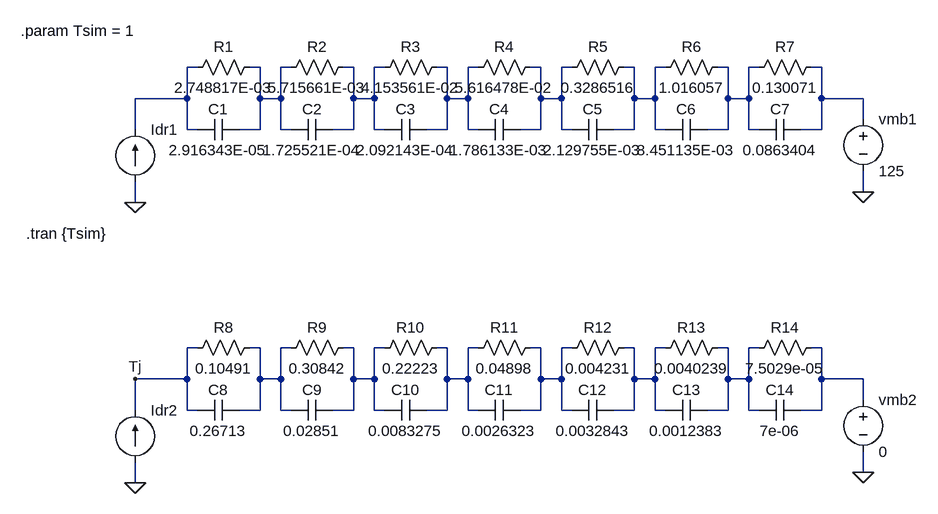
[diagram p0: schematic foster_test_matlab.asc]
* foster_test_matlab.asc
Idr1 0 N001 PWL(0              0          9e-10              0          1e-09              1  1.0209607e-09              1  1.0423607e-09              1  1.0642092e-09              1  1.0865158e-09              1  1.1092899e-09              1  1.1325413e-09              1  1.1562801e-09              1  1.1805165e-09              1  1.2052609e-09              1   1.230524e-09              1  1.2563166e-09              1  1.2826498e-09              1   1.309535e-09              1  1.3369837e-09              1  1.3650078e-09              1  1.3936193e-09              1  1.4228305e-09              1  1.4526539e-09              1  1.4831025e-09              1  1.5141893e-09              1  1.5459277e-09              1  1.5783314e-09              1  1.6114143e-09              1  1.6451906e-09              1  1.6796749e-09              1   1.714882e-09              1   1.750827e-09              1  1.7875255e-09              1  1.8249932e-09              1  1.8632463e-09              1  1.9023012e-09              0  1.9421747e-09              0  1.9828839e-09              0  2.0244465e-09              0  2.0668802e-09              1  2.1102034e-09              1  2.1544347e-09              1  2.1995931e-09              1   2.245698e-09              1  2.2927693e-09              1  2.3408273e-09              1  2.3898926e-09              1  2.4399863e-09              1    2.49113e-09              1  2.5433458e-09              1   2.596656e-09              1  2.6510836e-09              1  2.7066521e-09              1  2.7633853e-09              1  2.8213077e-09              1  2.8804442e-09              1  2.9408202e-09              1  3.0024617e-09              1  3.0653953e-09              1   3.129648e-09              1  3.1952475e-09              1   3.262222e-09              1  3.3306003e-09              1  3.4004119e-09              1  3.4716868e-09              1  3.5444557e-09              1  3.6187498e-09              1  3.6946012e-09              1  3.7720425e-09              1   3.851107e-09              1  3.9318288e-09              0  4.0142425e-09              0  4.0983837e-09              0  4.1842885e-09              0   4.271994e-09              1  4.3615378e-09              1  4.4529585e-09              1  4.5462955e-09              1  4.6415888e-09              1  4.7388796e-09              1  4.8382097e-09              1  4.9396217e-09              1  5.0431595e-09              1  5.1488675e-09              1  5.2567911e-09              1  5.3669769e-09              1  5.4794723e-09              1  5.5943257e-09              1  5.7115865e-09              1  5.8313051e-09              1  5.9535331e-09              1  6.0783231e-09              1  6.2057288e-09              1   6.335805e-09              1  6.4686077e-09              1   6.604194e-09              1  6.7426222e-09              1  6.8839521e-09              1  7.0282443e-09              1  7.1755609e-09              1  7.3259654e-09              1  7.4795225e-09              1  7.6362983e-09              1  7.7963601e-09              1   7.959777e-09              1  8.1266192e-09              0  8.2969585e-09              0  8.4708683e-09              0  8.6484233e-09              0     8.8297e-09              1  9.0147763e-09              1   9.203732e-09              1  9.3966483e-09              1  9.5936083e-09              1  9.7946967e-09              1          1e-08              1  1.0209607e-08              1  1.0423607e-08              1  1.0642092e-08              1  1.0865158e-08              1  1.1092899e-08              1  1.1325413e-08              1  1.1562801e-08              1  1.1805165e-08              1  1.2052609e-08              1   1.230524e-08              1  1.2563166e-08              1  1.2826498e-08              1   1.309535e-08              1  1.3369837e-08              1  1.3650078e-08              1  1.3936193e-08              1  1.4228305e-08              1  1.4526539e-08              1  1.4831025e-08              1  1.5141893e-08              1  1.5459277e-08              1  1.5783314e-08              1  1.6114143e-08              1  1.6451906e-08              1  1.6796749e-08              0   1.714882e-08              0   1.750827e-08              0  1.7875255e-08              0  1.8249932e-08              1  1.8632463e-08              1  1.9023012e-08              1  1.9421747e-08              1  1.9828839e-08              1  2.0244465e-08              1  2.0668802e-08              1  2.1102034e-08              1  2.1544347e-08              1  2.1995931e-08              1   2.245698e-08              1  2.2927693e-08              1  2.3408273e-08              1  2.3898926e-08              1  2.4399863e-08              1    2.49113e-08              1  2.5433458e-08              1   2.596656e-08              1  2.6510836e-08              1  2.7066521e-08              1  2.7633853e-08              1  2.8213077e-08              1  2.8804442e-08              1  2.9408202e-08              1  3.0024617e-08              1  3.0653953e-08              1   3.129648e-08              1  3.1952475e-08              1   3.262222e-08              1  3.3306003e-08              1  3.4004119e-08              1  3.4716868e-08              0  3.5444557e-08              0  3.6187498e-08              0  3.6946012e-08              0  3.7720425e-08              1   3.851107e-08              1  3.9318288e-08              1  4.0142425e-08              1  4.0983837e-08              1  4.1842885e-08              1   4.271994e-08              1  4.3615378e-08              1  4.4529585e-08              1  4.5462955e-08              1  4.6415888e-08              1  4.7388796e-08              1  4.8382097e-08              1  4.9396217e-08              1  5.0431595e-08              1  5.1488675e-08              1  5.2567911e-08              1  5.3669769e-08              1  5.4794723e-08              1  5.5943257e-08              1  5.7115865e-08              1  5.8313051e-08              1  5.9535331e-08              1  6.0783231e-08              1  6.2057288e-08              1   6.335805e-08              1  6.4686077e-08              1   6.604194e-08              1  6.7426222e-08              1  6.8839521e-08              1  7.0282443e-08              1  7.1755609e-08              0  7.3259654e-08              0  7.4795225e-08              0  7.6362983e-08              0  7.7963601e-08              1   7.959777e-08              1  8.1266192e-08              1  8.2969585e-08              1  8.4708683e-08              1  8.6484233e-08              1     8.8297e-08              1  9.0147763e-08              1   9.203732e-08              1  9.3966483e-08              1  9.5936083e-08              1  9.7946967e-08              1          1e-07              1  1.0209607e-07              1  1.0423607e-07              1  1.0642092e-07              1  1.0865158e-07              1  1.1092899e-07              1  1.1325413e-07              1  1.1562801e-07              1  1.1805165e-07              1  1.2052609e-07              1   1.230524e-07              1  1.2563166e-07              1  1.2826498e-07              1   1.309535e-07              1  1.3369837e-07              1  1.3650078e-07              1  1.3936193e-07              1  1.4228305e-07              1  1.4526539e-07              1  1.4831025e-07              0  1.5141893e-07              0  1.5459277e-07              0  1.5783314e-07              0  1.6114143e-07              1  1.6451906e-07              1  1.6796749e-07              1   1.714882e-07              1   1.750827e-07              1  1.7875255e-07              1  1.8249932e-07              1  1.8632463e-07              1  1.9023012e-07              1  1.9421747e-07              1  1.9828839e-07              1  2.0244465e-07              1  2.0668802e-07              1  2.1102034e-07              1  2.1544347e-07              1  2.1995931e-07              1   2.245698e-07              1  2.2927693e-07              1  2.3408273e-07              1  2.3898926e-07              1  2.4399863e-07              1    2.49113e-07              1  2.5433458e-07              1   2.596656e-07              1  2.6510836e-07              1  2.7066521e-07              1  2.7633853e-07              1  2.8213077e-07              1  2.8804442e-07              1  2.9408202e-07              1  3.0024617e-07              1  3.0653953e-07              0   3.129648e-07              0  3.1952475e-07              0   3.262222e-07              0  3.3306003e-07              1  3.4004119e-07              1  3.4716868e-07              1  3.5444557e-07              1  3.6187498e-07              1  3.6946012e-07              1  3.7720425e-07              1   3.851107e-07              1  3.9318288e-07              1  4.0142425e-07              1  4.0983837e-07              1  4.1842885e-07              1   4.271994e-07              1  4.3615378e-07              1  4.4529585e-07              1  4.5462955e-07              1  4.6415888e-07              1  4.7388796e-07              1  4.8382097e-07              1  4.9396217e-07              1  5.0431595e-07              1  5.1488675e-07              1  5.2567911e-07              1  5.3669769e-07              1  5.4794723e-07              1  5.5943257e-07              1  5.7115865e-07              1  5.8313051e-07              1  5.9535331e-07              1  6.0783231e-07              1  6.2057288e-07              1   6.335805e-07              0  6.4686077e-07              0   6.604194e-07              0  6.7426222e-07              0  6.8839521e-07              1  7.0282443e-07              1  7.1755609e-07              1  7.3259654e-07              1  7.4795225e-07              1  7.6362983e-07              1  7.7963601e-07              1   7.959777e-07              1  8.1266192e-07              1  8.2969585e-07              1  8.4708683e-07              1  8.6484233e-07              1     8.8297e-07              1  9.0147763e-07              1   9.203732e-07              1  9.3966483e-07              1  9.5936083e-07              1  9.7946967e-07              1          1e-06              1  1.0209607e-06              1  1.0423607e-06              1  1.0642092e-06              1  1.0865158e-06              1  1.1092899e-06              1  1.1325413e-06              1  1.1562801e-06              1  1.1805165e-06              1  1.2052609e-06              1   1.230524e-06              1  1.2563166e-06              1  1.2826498e-06              1   1.309535e-06              0  1.3369837e-06              0  1.3650078e-06              0  1.3936193e-06              0  1.4228305e-06              1  1.4526539e-06              1  1.4831025e-06              1  1.5141893e-06              1  1.5459277e-06              1  1.5783314e-06              1  1.6114143e-06              1  1.6451906e-06              1  1.6796749e-06              1   1.714882e-06              1   1.750827e-06              1  1.7875255e-06              1  1.8249932e-06              1  1.8632463e-06              1  1.9023012e-06              1  1.9421747e-06              1  1.9828839e-06              1  2.0244465e-06              1  2.0668802e-06              1  2.1102034e-06              1  2.1544347e-06              1  2.1995931e-06              1   2.245698e-06              1  2.2927693e-06              1  2.3408273e-06              1  2.3898926e-06              1  2.4399863e-06              1    2.49113e-06              1  2.5433458e-06              1   2.596656e-06              1  2.6510836e-06              1  2.7066521e-06              0  2.7633853e-06              0  2.8213077e-06              0  2.8804442e-06              0  2.9408202e-06              1  3.0024617e-06              1  3.0653953e-06              1   3.129648e-06              1  3.1952475e-06              1   3.262222e-06              1  3.3306003e-06              1  3.4004119e-06              1  3.4716868e-06              1  3.5444557e-06              1  3.6187498e-06              1  3.6946012e-06              1  3.7720425e-06              1   3.851107e-06              1  3.9318288e-06              1  4.0142425e-06              1  4.0983837e-06              1  4.1842885e-06              1   4.271994e-06              1  4.3615378e-06              1  4.4529585e-06              1  4.5462955e-06              1  4.6415888e-06              1  4.7388796e-06              1  4.8382097e-06              1  4.9396217e-06              1  5.0431595e-06              1  5.1488675e-06              1  5.2567911e-06              1  5.3669769e-06              1  5.4794723e-06              1  5.5943257e-06              0  5.7115865e-06              0  5.8313051e-06              0  5.9535331e-06              0  6.0783231e-06              1  6.2057288e-06              1   6.335805e-06              1  6.4686077e-06              1   6.604194e-06              1  6.7426222e-06              1  6.8839521e-06              1  7.0282443e-06              1  7.1755609e-06              1  7.3259654e-06              1  7.4795225e-06              1  7.6362983e-06              1  7.7963601e-06              1   7.959777e-06              1  8.1266192e-06              1  8.2969585e-06              1  8.4708683e-06              1  8.6484233e-06              1     8.8297e-06              1  9.0147763e-06              1   9.203732e-06              1  9.3966483e-06              1  9.5936083e-06              1  9.7946967e-06              1          1e-05              1  1.0209607e-05              1  1.0423607e-05              1  1.0642092e-05              1  1.0865158e-05              1  1.1092899e-05              1  1.1325413e-05              1  1.1562801e-05              0  1.1805165e-05              0  1.2052609e-05              0   1.230524e-05              0  1.2563166e-05              1  1.2826498e-05              1   1.309535e-05              1  1.3369837e-05              1  1.3650078e-05              1  1.3936193e-05              1  1.4228305e-05              1  1.4526539e-05              1  1.4831025e-05              1  1.5141893e-05              1  1.5459277e-05              1  1.5783314e-05              1  1.6114143e-05              1  1.6451906e-05              1  1.6796749e-05              1   1.714882e-05              1   1.750827e-05              1  1.7875255e-05              1  1.8249932e-05              1  1.8632463e-05              1  1.9023012e-05              1  1.9421747e-05              1  1.9828839e-05              1  2.0244465e-05              1  2.0668802e-05              1  2.1102034e-05              1  2.1544347e-05              1  2.1995931e-05              1   2.245698e-05              1  2.2927693e-05              1  2.3408273e-05              1  2.3898926e-05              0  2.4399863e-05              0    2.49113e-05              0  2.5433458e-05              0   2.596656e-05              1  2.6510836e-05              1  2.7066521e-05              1  2.7633853e-05              1  2.8213077e-05              1  2.8804442e-05              1  2.9408202e-05              1  3.0024617e-05              1  3.0653953e-05              1   3.129648e-05              1  3.1952475e-05              1   3.262222e-05              1  3.3306003e-05              1  3.4004119e-05              1  3.4716868e-05              1  3.5444557e-05              1  3.6187498e-05              1  3.6946012e-05              1  3.7720425e-05              1   3.851107e-05              1  3.9318288e-05              1  4.0142425e-05              1  4.0983837e-05              1  4.1842885e-05              1   4.271994e-05              1  4.3615378e-05              1  4.4529585e-05              1  4.5462955e-05              1  4.6415888e-05              1  4.7388796e-05              1  4.8382097e-05              1  4.9396217e-05              0  5.0431595e-05              0  5.1488675e-05              0  5.2567911e-05              0  5.3669769e-05              1  5.4794723e-05              1  5.5943257e-05              1  5.7115865e-05              1  5.8313051e-05              1  5.9535331e-05              1  6.0783231e-05              1  6.2057288e-05              1   6.335805e-05              1  6.4686077e-05              1   6.604194e-05              1  6.7426222e-05              1  6.8839521e-05              1  7.0282443e-05              1  7.1755609e-05              1  7.3259654e-05              1  7.4795225e-05              1  7.6362983e-05              1  7.7963601e-05              1   7.959777e-05              1  8.1266192e-05              1  8.2969585e-05              1  8.4708683e-05              1  8.6484233e-05              1     8.8297e-05              1  9.0147763e-05              1   9.203732e-05              1  9.3966483e-05              1  9.5936083e-05              1  9.7946967e-05              1         0.0001              1  0.00010209607              0  0.00010423607              0  0.00010642092              0  0.00010865158              0  0.00011092899              1  0.00011325413              1  0.00011562801              1  0.00011805165              1  0.00012052609              1   0.0001230524              1  0.00012563166              1  0.00012826498              1   0.0001309535              1  0.00013369837              1  0.00013650078              1  0.00013936193              1  0.00014228305              1  0.00014526539              1  0.00014831025              1  0.00015141893              1  0.00015459277              1  0.00015783314              1  0.00016114143              1  0.00016451906              1  0.00016796749              1   0.0001714882              1   0.0001750827              1  0.00017875255              1  0.00018249932              1  0.00018632463              1  0.00019023012              1  0.00019421747              1  0.00019828839              1  0.00020244465              1  0.00020668802              1  0.00021102034              0  0.00021544347              0  0.00021995931              0   0.0002245698              0  0.00022927693              1  0.00023408273              1  0.00023898926              1  0.00024399863              1    0.000249113              1  0.00025433458              1   0.0002596656              1  0.00026510836              1  0.00027066521              1  0.00027633853              1  0.00028213077              1  0.00028804442              1  0.00029408202              1  0.00030024617              1  0.00030653953              1   0.0003129648              1  0.00031952475              1   0.0003262222              1  0.00033306003              1  0.00034004119              1  0.00034716868              1  0.00035444557              1  0.00036187498              1  0.00036946012              1  0.00037720425              1   0.0003851107              1  0.00039318288              1  0.00040142425              1  0.00040983837              1  0.00041842885              1   0.0004271994              1  0.00043615378              0  0.00044529585              0  0.00045462955              0  0.00046415888              0  0.00047388796              1  0.00048382097              1  0.00049396217              1  0.00050431595              1  0.00051488675              1  0.00052567911              1  0.00053669769              1  0.00054794723              1  0.00055943257              1  0.00057115865              1  0.00058313051              1  0.00059535331              1  0.00060783231              1  0.00062057288              1   0.0006335805              1  0.00064686077              1   0.0006604194              1  0.00067426222              1  0.00068839521              1  0.00070282443              1  0.00071755609              1  0.00073259654              1  0.00074795225              1  0.00076362983              1  0.00077963601              1   0.0007959777              1  0.00081266192              1  0.00082969585              1  0.00084708683              1  0.00086484233              1     0.00088297              1  0.00090147763              0   0.0009203732              0  0.00093966483              0  0.00095936083              0  0.00097946967              1          0.001              1   0.0010209607              1   0.0010423607              1   0.0010642092              1   0.0010865158              1   0.0011092899              1   0.0011325413              1   0.0011562801              1   0.0011805165              1   0.0012052609              1    0.001230524              1   0.0012563166              1   0.0012826498              1    0.001309535              1   0.0013369837              1   0.0013650078              1   0.0013936193              1   0.0014228305              1   0.0014526539              1   0.0014831025              1   0.0015141893              1   0.0015459277              1   0.0015783314              1   0.0016114143              1   0.0016451906              1   0.0016796749              1    0.001714882              1    0.001750827              1   0.0017875255              1   0.0018249932              1   0.0018632463              0   0.0019023012              0   0.0019421747              0   0.0019828839              0   0.0020244465              1   0.0020668802              1   0.0021102034              1   0.0021544347              1   0.0021995931              1    0.002245698              1   0.0022927693              1   0.0023408273              1   0.0023898926              1   0.0024399863              1     0.00249113              1   0.0025433458              1    0.002596656              1   0.0026510836              1   0.0027066521              1   0.0027633853              1   0.0028213077              1   0.0028804442              1   0.0029408202              1   0.0030024617              1   0.0030653953              1    0.003129648              1   0.0031952475              1    0.003262222              1   0.0033306003              1   0.0034004119              1   0.0034716868              1   0.0035444557              1   0.0036187498              1   0.0036946012              1   0.0037720425              1    0.003851107              0   0.0039318288              0   0.0040142425              0   0.0040983837              0   0.0041842885              1    0.004271994              1   0.0043615378              1   0.0044529585              1   0.0045462955              1   0.0046415888              1   0.0047388796              1   0.0048382097              1   0.0049396217              1   0.0050431595              1   0.0051488675              1   0.0052567911              1   0.0053669769              1   0.0054794723              1   0.0055943257              1   0.0057115865              1   0.0058313051              1   0.0059535331              1   0.0060783231              1   0.0062057288              1    0.006335805              1   0.0064686077              1    0.006604194              1   0.0067426222              1   0.0068839521              1   0.0070282443              1   0.0071755609              1   0.0073259654              1   0.0074795225              1   0.0076362983              1   0.0077963601              1    0.007959777              0   0.0081266192              0   0.0082969585              0   0.0084708683              0   0.0086484233              1      0.0088297              1   0.0090147763              1    0.009203732              1   0.0093966483              1   0.0095936083              1   0.0097946967              1           0.01              1    0.010209607              1    0.010423607              1    0.010642092              1    0.010865158              1    0.011092899              1    0.011325413              1    0.011562801              1    0.011805165              1    0.012052609              1     0.01230524              1    0.012563166              1    0.012826498              1     0.01309535              1    0.013369837              1    0.013650078              1    0.013936193              1    0.014228305              1    0.014526539              1    0.014831025              1    0.015141893              1    0.015459277              1    0.015783314              1    0.016114143              1    0.016451906              0    0.016796749              0     0.01714882              0     0.01750827              0    0.017875255              1    0.018249932              1    0.018632463              1    0.019023012              1    0.019421747              1    0.019828839              1    0.020244465              1    0.020668802              1    0.021102034              1    0.021544347              1    0.021995931              1     0.02245698              1    0.022927693              1    0.023408273              1    0.023898926              1    0.024399863              1      0.0249113              1    0.025433458              1     0.02596656              1    0.026510836              1    0.027066521              1    0.027633853              1    0.028213077              1    0.028804442              1    0.029408202              1    0.030024617              1    0.030653953              1     0.03129648              1    0.031952475              1     0.03262222              1    0.033306003              1    0.034004119              0    0.034716868              0    0.035444557              0    0.036187498              0    0.036946012              1    0.037720425              1     0.03851107              1    0.039318288              1    0.040142425              1    0.040983837              1    0.041842885              1     0.04271994              1    0.043615378              1    0.044529585              1    0.045462955              1    0.046415888              1    0.047388796              1    0.048382097              1    0.049396217              1    0.050431595              1    0.051488675              1    0.052567911              1    0.053669769              1    0.054794723              1    0.055943257              1    0.057115865              1    0.058313051              1    0.059535331              1    0.060783231              1    0.062057288              1     0.06335805              1    0.064686077              1     0.06604194              1    0.067426222              1    0.068839521              1    0.070282443              0    0.071755609              0    0.073259654              0    0.074795225              0    0.076362983              1    0.077963601              1     0.07959777              1    0.081266192              1    0.082969585              1    0.084708683              1    0.086484233              1       0.088297              1    0.090147763              1     0.09203732              1    0.093966483              1    0.095936083              1    0.097946967              1            0.1              1     0.10209607              1     0.10423607              1     0.10642092              1     0.10865158              1     0.11092899              1     0.11325413              1     0.11562801              1     0.11805165              1     0.12052609              1      0.1230524              1     0.12563166              1     0.12826498              1      0.1309535              1     0.13369837              1     0.13650078              1     0.13936193              1     0.14228305              1     0.14526539              0     0.14831025              0     0.15141893              0     0.15459277              0     0.15783314              1     0.16114143              1     0.16451906              1     0.16796749              1      0.1714882              1      0.1750827              1     0.17875255              1     0.18249932              1     0.18632463              1     0.19023012              1     0.19421747              1     0.19828839              1     0.20244465              1     0.20668802              1     0.21102034              1     0.21544347              1     0.21995931              1      0.2245698              1     0.22927693              1     0.23408273              1     0.23898926              1     0.24399863              1       0.249113              1     0.25433458              1      0.2596656              1     0.26510836              1     0.27066521              1     0.27633853              1     0.28213077              1     0.28804442              1     0.29408202              1     0.30024617              0     0.30653953              0      0.3129648              0     0.31952475              0      0.3262222              1     0.33306003              1     0.34004119              1     0.34716868              1     0.35444557              1     0.36187498              1     0.36946012              1     0.37720425              1      0.3851107              1     0.39318288              1     0.40142425              1     0.40983837              1     0.41842885              1      0.4271994              1     0.43615378              1     0.44529585              1     0.45462955              1     0.46415888              1     0.47388796              1     0.48382097              1     0.49396217              1     0.50431595              1     0.51488675              1     0.52567911              1     0.53669769              1     0.54794723              1     0.55943257              1     0.57115865              1     0.58313051              1     0.59535331              1     0.60783231              1     0.62057288              0      0.6335805              0     0.64686077              0      0.6604194              0     0.67426222              1     0.68839521              1     0.70282443              1     0.71755609              1     0.73259654              1     0.74795225              1     0.76362983              1     0.77963601              1      0.7959777              1     0.81266192              1     0.82969585              1     0.84708683              1     0.86484233              1        0.88297              1     0.90147763              1      0.9203732              1     0.93966483              1     0.95936083              1     0.97946967              1              1              1)
R1 N001 N002 2.748817E-03
R2 N002 N003 5.715661E-03
R3 N003 N004 4.153561E-02
R4 N004 N005 5.616478E-02
R5 N005 N006 0.3286516
R6 N006 N007 1.016057
R7 N007 N008 0.130071
C1 N001 N002 2.916343E-05
C2 N002 N003 1.725521E-04
C3 N003 N004 2.092143E-04
C4 N004 N005 1.786133E-03
C5 N005 N006 2.129755E-03
C6 N006 N007 8.451135E-03
C7 N007 N008 0.0863404
vmb1 N008 0 125